# EAGLE schematic NMOS_DESIGN (EAGLE 8.0.2)
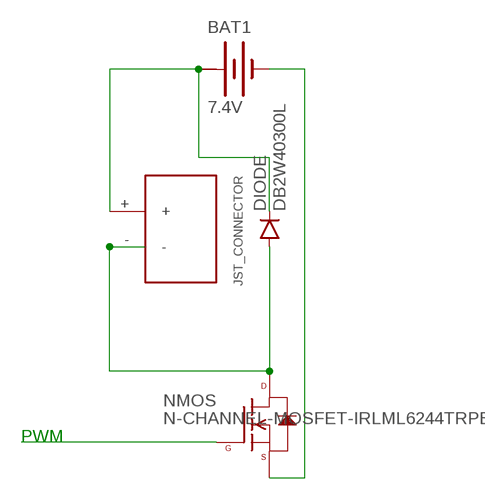
[diagram p0: schematic, sheet 1]

## Parts
BAT1  7.4V  BATTERY  [BATTERY]
DIODE  DB2W40300L  [MINI2-F3-B]
MOTOR  JST_CONNECTOR_FEMALE  [JST_CONNECTOR_FEMALE]
NMOS  N-CHANNEL-MOSFET-IRLML6244TRPBF  [SOT23-3]

## Nets
N$1: BAT1.+ DIODE.NEG(GPIN) MOTOR.+
N$2: DIODE.POS(PPIN) MOTOR.- NMOS.3(D)
N$3: BAT1.- NMOS.2(S)
N$5: NMOS.1(G)

## Notes on the sheet
- PWM

## Power pins joined to a net without a drawn wire
+: BAT1.+@1(+)

## Library data of the parts
BAT1 = special:BATTERY: BATTERY
DIODE = quad:DB2W40300L
MOTOR = quad:JST_CONNECTOR_FEMALE
NMOS = quad:N-CHANNEL-MOSFET: N-Channel MOSFET Mode Field Effect Transistor; DATASHEET: http://www.mouser.com/ds/2/196/irlml6244pbf-936666.pdf; MOUSER: 942-IRLML6244TRPBF; URL: http://www.mouser.com/Search/ProductDetail.aspx?R=IRLML6244TRPBFvirtualkey57370000virtualkey942-IRLML6244TRPBF